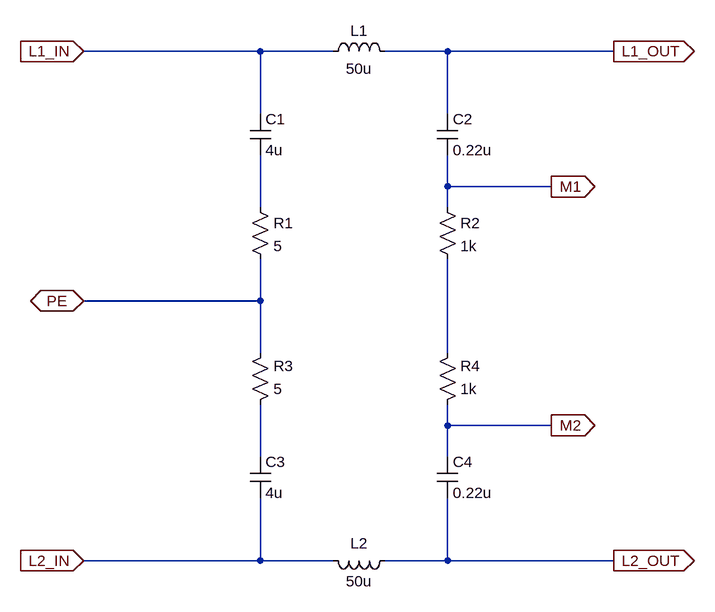
[diagram p0: schematic LISN50.asc]
LISN50.asc, the LTspice schematic file:
Version 4.1
SHEET 1 880 888
WIRE -48 32 -320 32
WIRE 64 32 -48 32
WIRE 240 32 144 32
WIRE 496 32 240 32
WIRE -48 128 -48 32
WIRE 240 128 240 32
WIRE 240 240 240 192
WIRE 400 240 240 240
WIRE -48 272 -48 192
WIRE 240 272 240 240
WIRE -48 416 -48 352
WIRE -48 416 -320 416
WIRE -48 496 -48 416
WIRE 240 496 240 352
WIRE 240 608 240 576
WIRE 400 608 240 608
WIRE -48 656 -48 576
WIRE 240 656 240 608
WIRE -48 816 -48 720
WIRE -48 816 -320 816
WIRE 64 816 -48 816
WIRE 240 816 240 720
WIRE 240 816 144 816
WIRE 496 816 240 816
FLAG -320 416 PE
IOPIN -320 416 BiDir
FLAG -320 32 L1_IN
IOPIN -320 32 In
FLAG 496 32 L1_OUT
IOPIN 496 32 Out
FLAG -320 816 L2_IN
IOPIN -320 816 In
FLAG 496 816 L2_OUT
IOPIN 496 816 Out
FLAG 400 240 M1
IOPIN 400 240 Out
FLAG 400 608 M2
IOPIN 400 608 Out
SYMBOL ind 48 48 R270
WINDOW 0 32 56 VTop 2
WINDOW 3 5 56 VBottom 2
SYMATTR InstName L1
SYMATTR Value 50u
SYMATTR SpiceLine Rser=1m
SYMBOL cap -64 128 R0
SYMATTR InstName C1
SYMATTR Value 4u
SYMBOL res -64 256 R0
SYMATTR InstName R1
SYMATTR Value 5
SYMBOL cap 224 128 R0
SYMATTR InstName C2
SYMATTR Value 0.22u
SYMATTR SpiceLine V=1K Irms=0 Rser=0.0467 Lser=14.381n mfg="Würth Elektronik" pn="890493426011CS WCAP-FTBE 22.5 x 26 x 18 x 9" type="Box"
SYMBOL res 224 256 R0
SYMATTR InstName R2
SYMATTR Value 1k
SYMBOL ind 48 800 M90
WINDOW 0 5 56 VBottom 2
WINDOW 3 32 56 VTop 2
SYMATTR InstName L2
SYMATTR Value 50u
SYMATTR SpiceLine Rser=1m
SYMBOL cap -64 720 M180
WINDOW 0 24 56 Left 2
WINDOW 3 24 8 Left 2
SYMATTR InstName C3
SYMATTR Value 4u
SYMBOL res -64 592 M180
WINDOW 0 36 76 Left 2
WINDOW 3 36 40 Left 2
SYMATTR InstName R3
SYMATTR Value 5
SYMBOL cap 224 720 M180
WINDOW 0 24 56 Left 2
WINDOW 3 24 8 Left 2
SYMATTR InstName C4
SYMATTR Value 0.22u
SYMATTR SpiceLine V=1K Irms=0 Rser=0.0467 Lser=14.381n mfg="Würth Elektronik" pn="890493426011CS WCAP-FTBE 22.5 x 26 x 18 x 9" type="Box"
SYMBOL res 224 592 M180
WINDOW 0 36 76 Left 2
WINDOW 3 36 40 Left 2
SYMATTR InstName R4
SYMATTR Value 1k

The netlist it stands for:
* LISN50.asc
L1 L1_IN L1_OUT 50u Rser=1m
C1 L1_IN N001 4u
R1 N001 PE 5
C2 L1_OUT M1 0.22u V=1K Irms=0 Rser=0.0467 Lser=14.381n mfg="Würth Elektronik" pn="890493426011CS WCAP-FTBE 22.5 x 26 x 18 x 9" type="Box"
R2 M1 N002 1k
L2 L2_IN L2_OUT 50u Rser=1m
C3 L2_IN N003 4u
R3 N003 PE 5
C4 L2_OUT M2 0.22u V=1K Irms=0 Rser=0.0467 Lser=14.381n mfg="Würth Elektronik" pn="890493426011CS WCAP-FTBE 22.5 x 26 x 18 x 9" type="Box"
R4 M2 N002 1k
.backanno
.end